# Altium schematic sheet power_channel.SchDoc: Falcon MCU Power Channel
size A; DrawnBy: Joey Tomlinson; Engineer: Joey Tomlinson; Revision: 2
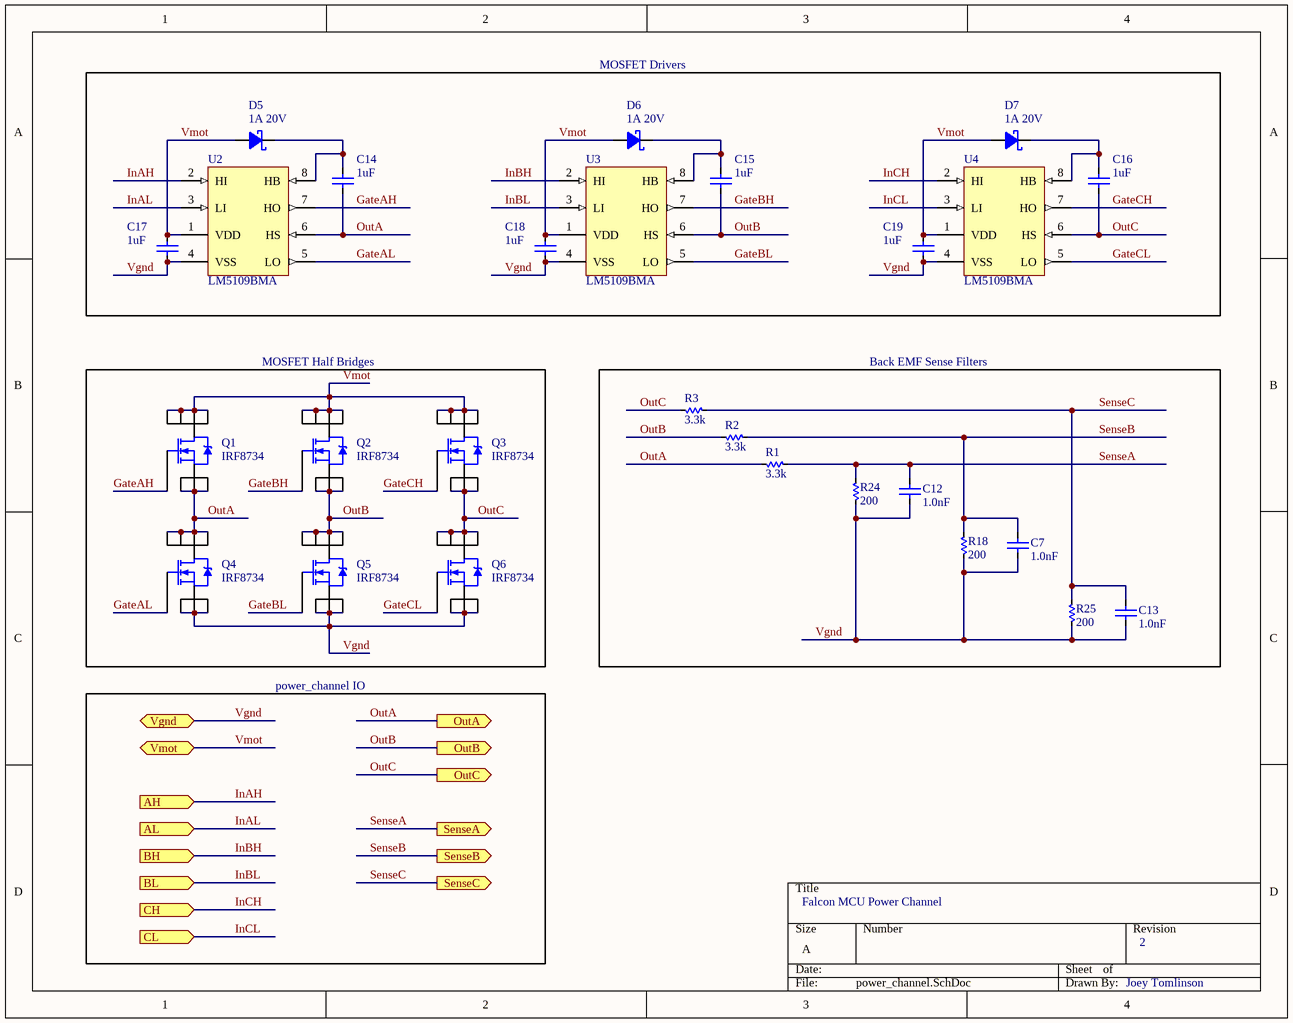
[diagram p0: power_channel.SchDoc]

## Parts
C7  value 1.0nF  [0603 (1608)]  (hidden comment: Capacitor)
C12  value 1.0nF  [0603 (1608)]  (hidden comment: Capacitor)
C13  value 1.0nF  [0603 (1608)]  (hidden comment: Capacitor)
C14  value 1uF  [0603 (1608)]  (hidden comment: Capacitor)
C15  value 1uF  [0603 (1608)]  (hidden comment: Capacitor)
C16  value 1uF  [0603 (1608)]  (hidden comment: Capacitor)
C17  value 1uF  [0603 (1608)]  (hidden comment: Capacitor)
C18  value 1uF  [0603 (1608)]  (hidden comment: Capacitor)
C19  value 1uF  [0603 (1608)]  (hidden comment: Capacitor)
D5  value 1A 20V  [SOD-323]  (hidden comment: Schottky Diode)
D6  value 1A 20V  [SOD-323]  (hidden comment: Schottky Diode)
D7  value 1A 20V  [SOD-323]  (hidden comment: Schottky Diode)
Q1  IRF8734  [SO8]
Q2  IRF8734  [SO8]
Q3  IRF8734  [SO8]
Q4  IRF8734  [SO8]
Q5  IRF8734  [SO8]
Q6  IRF8734  [SO8]
R1  value 3.3k  [0603 (1608)]  (hidden comment: Resistor)
R2  value 3.3k  [0603 (1608)]  (hidden comment: Resistor)
R3  value 3.3k  [0603 (1608)]  (hidden comment: Resistor)
R18  value 200  [0603 (1608)]  (hidden comment: Resistor)
R24  value 200  [0603 (1608)]  (hidden comment: Resistor)
R25  value 200  [0603 (1608)]  (hidden comment: Resistor)
U2  LM5109BMA  [M08A_N]
U3  LM5109BMA  [M08A_N]
U4  LM5109BMA  [M08A_N]

## Blocks framed on the sheet
MOSFET Drivers: C14-C19 D5-D7 U2-U4
MOSFET Half Bridges: Q1-Q6
Back EMF Sense Filters: C7 C12 C13 R1-R3 R18 R24 R25

## Ports
AH (in), AL (in), BH (in), BL (in), CH (in), CL (in), OutA (out), OutB (out), OutC (out), SenseA (out), SenseB (out), SenseC (out), Vgnd, Vmot

## Nets
GateAH: Q1.4(G) U2.7(HO)
GateAL: Q4.4(G) U2.5(LO)
GateBH: Q2.4(G) U3.7(HO)
GateBL: Q5.4(G) U3.5(LO)
GateCH: Q3.4(G) U4.7(HO)
GateCL: Q6.4(G) U4.5(LO)
InAH: U2.2(HI) ; port AH
InAL: U2.3(LI) ; port AL
InBH: U3.2(HI) ; port BH
InBL: U3.3(LI) ; port BL
InCH: U4.2(HI) ; port CH
InCL: U4.3(LI) ; port CL
OutA: C14.2 Q1.1(S) Q1.2(S) Q1.3(S) Q4.5(D) Q4.6(D) Q4.7(D) Q4.8(D) R1.2 U2.6(HS) ; port OutA
OutB: C15.2 Q2.1(S) Q2.2(S) Q2.3(S) Q5.5(D) Q5.6(D) Q5.7(D) Q5.8(D) R2.2 U3.6(HS) ; port OutB
OutC: C16.2 Q3.1(S) Q3.2(S) Q3.3(S) Q6.5(D) Q6.6(D) Q6.7(D) Q6.8(D) R3.2 U4.6(HS) ; port OutC
SenseA: C12.1 R1.1 R24.1 ; port SenseA
SenseB: C7.1 R2.1 R18.1 ; port SenseB
SenseC: C13.1 R3.1 R25.1 ; port SenseC
Vgnd: C7.2 C12.2 C13.2 C17.2 C18.2 C19.2 Q4.1(S) Q4.2(S) Q4.3(S) Q5.1(S) Q5.2(S) Q5.3(S) Q6.1(S) Q6.2(S) Q6.3(S) R18.2 R24.2 R25.2 U2.4(VSS) U3.4(VSS) U4.4(VSS) ; port Vgnd
Vmot: C17.1 C18.1 C19.1 D5.1 D6.1 D7.1 Q1.5(D) Q1.6(D) Q1.7(D) Q1.8(D) Q2.5(D) Q2.6(D) Q2.7(D) Q2.8(D) Q3.5(D) Q3.6(D) Q3.7(D) Q3.8(D) U2.1(VDD) U3.1(VDD) U4.1(VDD) ; port Vmot
NetC14_1: C14.1 D5.2 U2.8(HB)
NetC15_1: C15.1 D6.2 U3.8(HB)
NetC16_1: C16.1 D7.2 U4.8(HB)

## Notes on the sheet
- power_channel IO

## Library data of the parts
C7 C12 C13 = Capacitor: Part No.: CC0603JRNPO8BN102; Vendor: Digikey; Price Est.: $0.10
C14-C19 = Capacitor: Part No.: 445-3452-1-ND; Vendor: Digikey; Price Est.: 0.061
D5-D7 = Schottky Diode: Part No.: SDM100K30LDICT-ND; Vendor: Digikey; Price Est.: 0.54
Q1-Q6 = IRF8734: Part No.: IRF8734TRPBFCT-ND; Vendor: Digikey; Price Est.: 1.04
R1-R3 = Resistor: Part No.: RMCF0603JT3K30; Vendor: Digikey; Price Est.: 0.02
R18 R24 R25 = Resistor: Part No.: RMCF0603JT200R; Part No. Ref: CRCW[PACKAGE][VALUE]; Vendor: Digikey; Price Est.: 0.02
U2-U4 = LM5109BMA: High Voltage 1A Peak Half Bridge Gate Driver; Manufacturer: National Semiconductor; Part No.: LM5109BMA-ND; CompType: MiscPower; PackageTopMarking: NSZXTT*L5109*BMA; PowerWise: N; Vendor: Digikey; FirstPublished: 4-Dec-2008; DatasheetVersion: Feb-2007; PackageVersion: revL, Sep-2006; PackageReference: M08A; Publisher: Altium Limited; PackageDescription: SOIC Narrow, 4.9 x 3.9 x 1.45mm, 8 Lead, 1.27mm Pitch; PartNumber: LM5109BMA; RoHS: Y; PinCount: 8; DigiKeyPartNumber: LM5109BMA-ND; Code_JEDEC: MS-012-AA; Code_IPC: SOIC127P600-8; ComponentLink1Description: LM5109B Datasheet; ComponentLink1URL: http://www.national.com/ds/LM/LM5109B.pdf; ComponentLink2Description: LM5109B Web Page; ComponentLink2URL: http://www.national.com/pf/LM/LM5109B.html; ComponentLink3Description: M08A Package Page; ComponentLink3URL: http://www.national.com/packaging/folders/m08a.html; Price Est.: 1.70